# Altium project PumpSystem.PrjPCB (part 5 of 8)

## Sheet [07] - RS232.SchDoc
size A3; DocumentNumber: 8; SheetNumber: 8; SheetTotal: 12
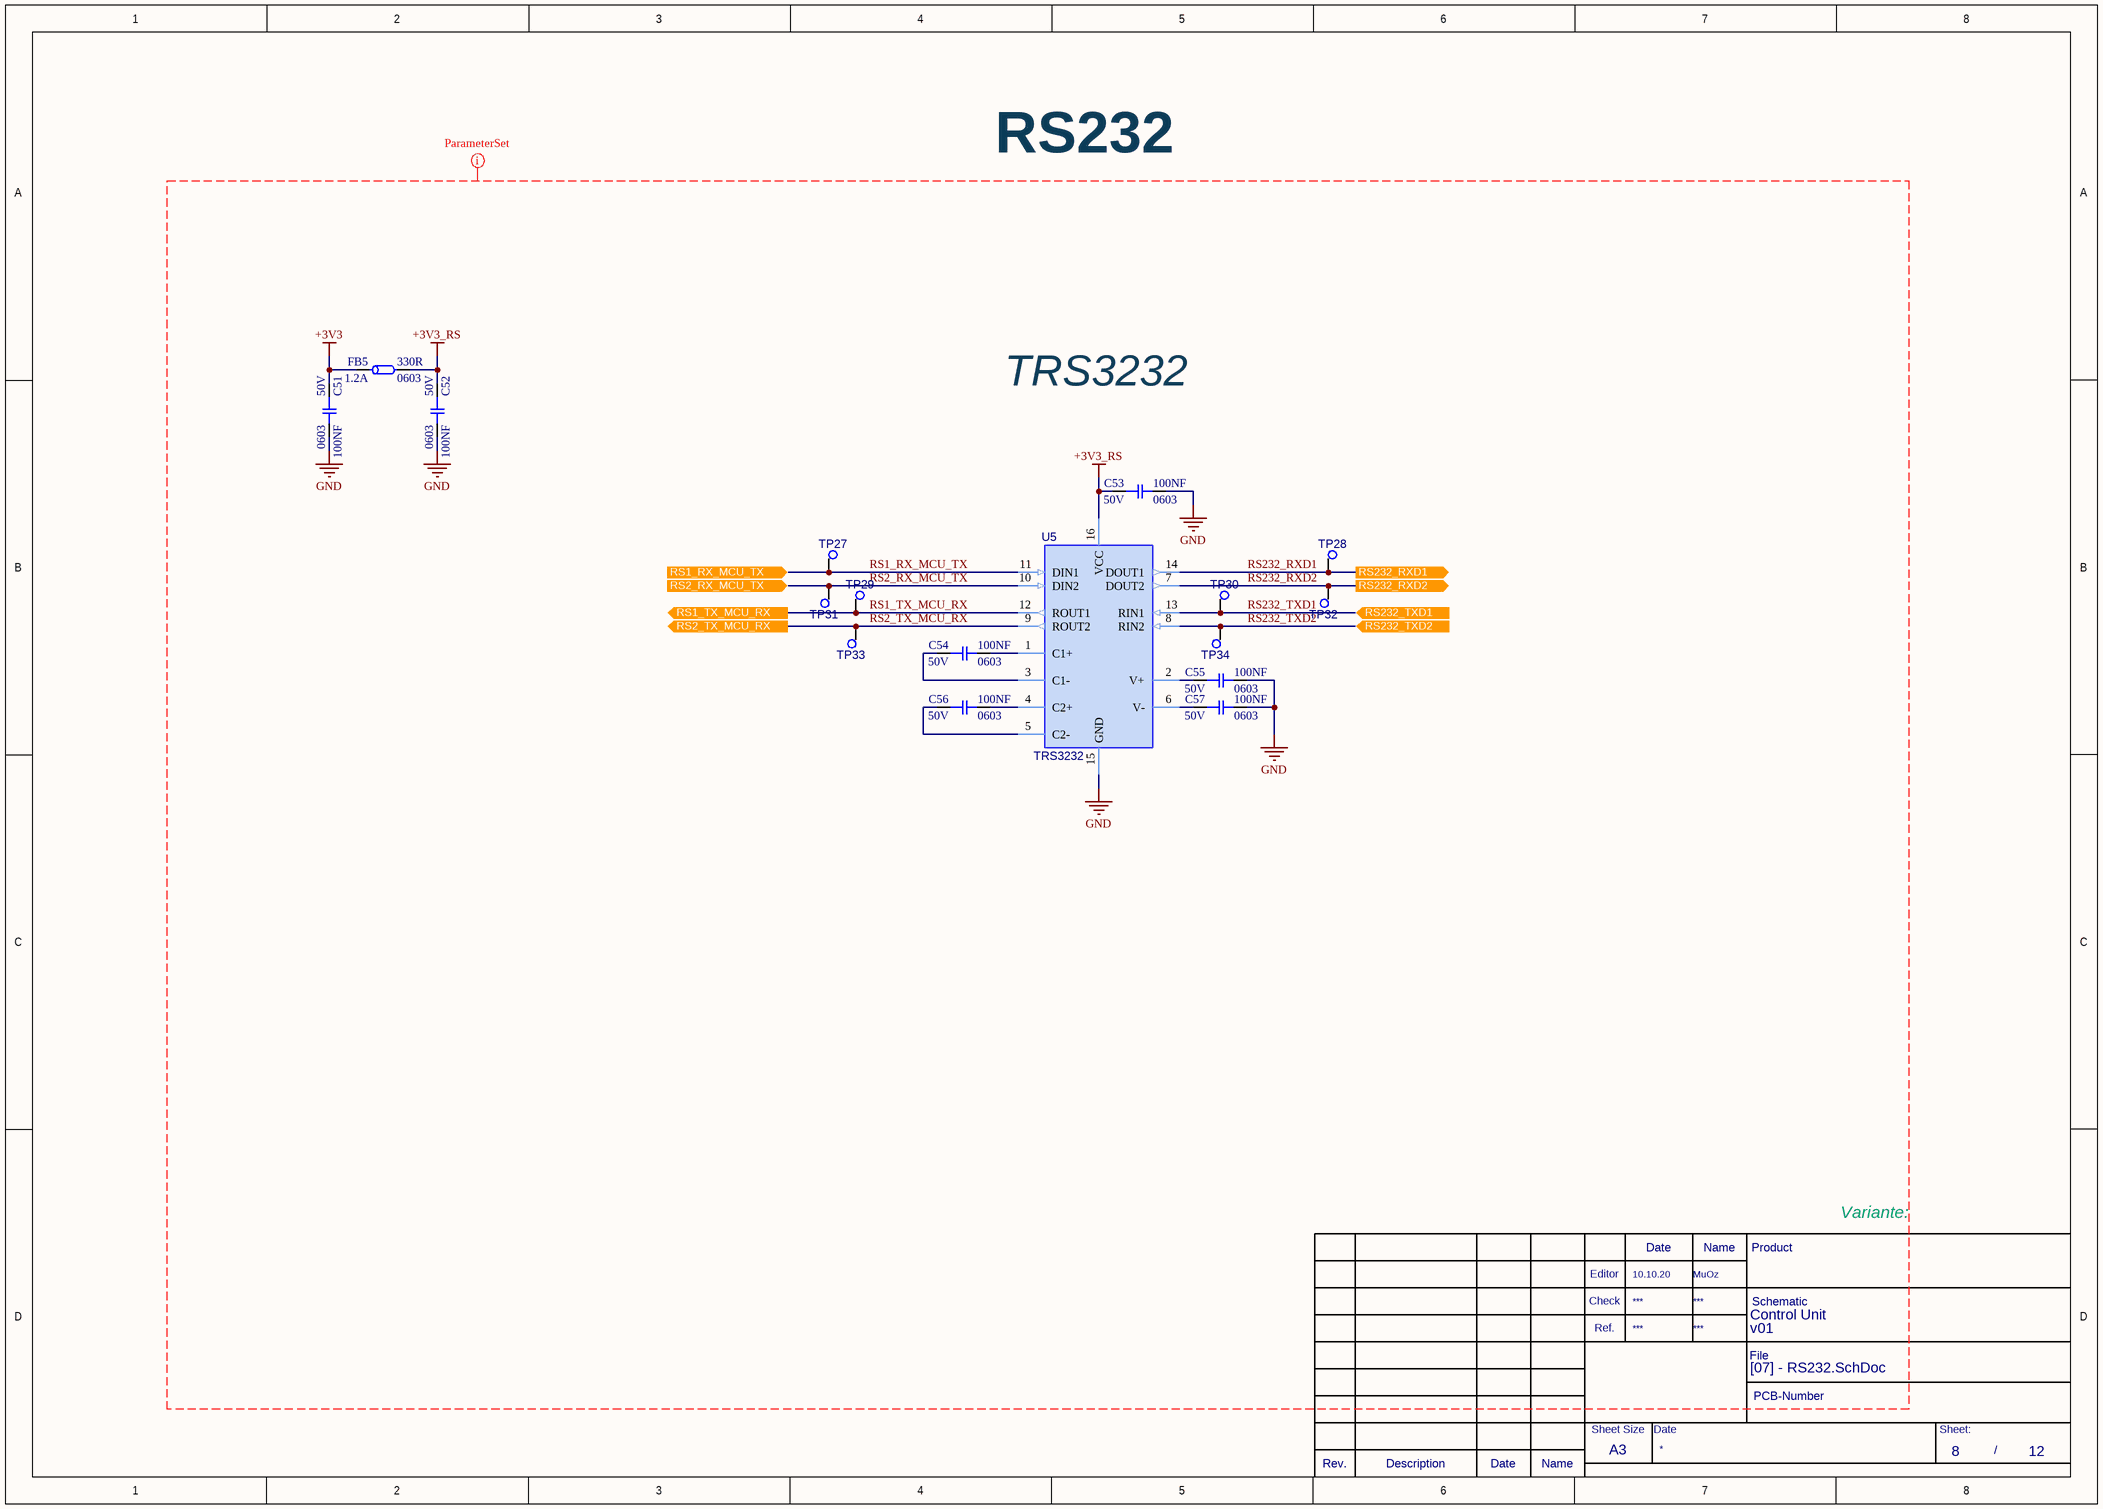
[diagram p7: [07] - RS232.SchDoc]

### Parts
C51  100NF  Voltage Rating: 50V  Case Code (Imperial): 0603  [C-0603]
C52  100NF  Voltage Rating: 50V  Case Code (Imperial): 0603  [C-0603]
C53  100NF  Voltage Rating: 50V  Case Code (Imperial): 0603  [C-0603]
C54  100NF  Voltage Rating: 50V  Case Code (Imperial): 0603  [C-0603]
C55  100NF  Voltage Rating: 50V  Case Code (Imperial): 0603  [C-0603]
C56  100NF  Voltage Rating: 50V  Case Code (Imperial): 0603  [C-0603]
C57  100NF  Voltage Rating: 50V  Case Code (Imperial): 0603  [C-0603]
FB5  330R  Case/Package: 0603  DC Current: 1.2A  [FB-0603]
TP27  MECH-TESTPOINT  [MECH-TESTPOINT]  (value not drawn)  (no BOM)
TP28  MECH-TESTPOINT  [MECH-TESTPOINT]  (value not drawn)  (no BOM)
TP29  MECH-TESTPOINT  [MECH-TESTPOINT]  (value not drawn)  (no BOM)
TP30  MECH-TESTPOINT  [MECH-TESTPOINT]  (value not drawn)  (no BOM)
TP31  MECH-TESTPOINT  [MECH-TESTPOINT]  (value not drawn)  (no BOM)
TP32  MECH-TESTPOINT  [MECH-TESTPOINT]  (value not drawn)  (no BOM)
TP33  MECH-TESTPOINT  [MECH-TESTPOINT]  (value not drawn)  (no BOM)
TP34  MECH-TESTPOINT  [MECH-TESTPOINT]  (value not drawn)  (no BOM)
U5  TRS3232  [TSSOP16]

### Ports
RS1_RX_MCU_TX (in), RS1_TX_MCU_RX (out), RS2_RX_MCU_TX (in), RS2_TX_MCU_RX (out), RS232_RXD1 (out), RS232_RXD2 (out), RS232_TXD1 (in), RS232_TXD2 (in)

### Nets
+3V3: C51.1 FB5.1
+3V3_RS: C52.1 C53.1 FB5.2 U5.16(VCC)
GND: C51.2 C52.2 C53.2 C55.2 C57.2 U5.15(GND)
RS1_RX_MCU_TX: TP27.1 U5.11(DIN1) ; port RS1_RX_MCU_TX
RS1_TX_MCU_RX: TP29.1 U5.12(ROUT1) ; port RS1_TX_MCU_RX
RS2_RX_MCU_TX: TP31.1 U5.10(DIN2) ; port RS2_RX_MCU_TX
RS2_TX_MCU_RX: TP33.1 U5.9(ROUT2) ; port RS2_TX_MCU_RX
RS232_RXD1: TP28.1 U5.14(DOUT1) ; port RS232_RXD1
RS232_RXD2: TP32.1 U5.7(DOUT2) ; port RS232_RXD2
RS232_TXD1: TP30.1 U5.13(RIN1) ; port RS232_TXD1
RS232_TXD2: TP34.1 U5.8(RIN2) ; port RS232_TXD2
NetC54_1: C54.1 U5.3(C1-)
NetC54_2: C54.2 U5.1(C1+)
NetC55_1: C55.1 U5.2(V+)
NetC56_1: C56.1 U5.5(C2-)
NetC56_2: C56.2 U5.4(C2+)
NetC57_1: C57.1 U5.6(V-)

### Layout directives
net class RS232: +3V3, +3V3_RS, GND, RS1_RX_MCU_TX, RS1_TX_MCU_RX, RS2_RX_MCU_TX, RS2_TX_MCU_RX, RS232_RXD1, RS232_RXD2, RS232_TXD1, RS232_TXD2

### Notes on the sheet
- RS232
- TRS3232
- Date
- Name
- Product
- Variante:
- Editor
- Check
- Ref.
- Schematic
- File
- PCB-Number
- Rev.
- Description
- Sheet Size
- A3
- Sheet:
- /

### Library data of the parts
C51-C57 = C-100NF-0603: CAP CER 0.1UF 50V X7R 0603; Manufacturer: TDK; Manufacturer Part Number: C1608X7R1H104K080AA; Tolerance: 10%; Dielectric Material: Ceramic; .PCBCHK: USED; .Creator: F:TALI; Washability: OK; Temperature Coefficient: 30ppm/°C; Mount: Surface Mount; Case/Package: 0603; Case Code (Metric): 1608; Min Operating Temperature: -55°C; Max Operating Temperature: 125°C; Package Quantity: 1; Packaging: Tape and Reel; Features: Soft Termination; Length: 1.6mm; Width: 0.8mm; Thickness: 0.037inch; Lead Free: Lead Free; Capacitance: 100nF; Supplier 1: Digi-Key; Supplier Part Number 1: 445-1314-1-ND; Stock 1: 0; Pricing 1: 1=0.1, 10=0.057, 100=0.0254, 500=0.01812, 1000=0.01423 (USD); Contact Plating: Matte,Tin; Voltage Rating (DC): 50V; Dielectric: X7R; Termination: SMD/SMT; Voltage: 50V; Height: 0.8mm; Depth: 0.8mm; REACH SVHC: No SVHC; ComponentLink1URL: http://www.mouser.com/ds/2/400/lcc_commercial_general_en-837201.pdf; ComponentLink1Description: http://www.mouser.com/ds/2/400/lcc_commercial_general_en-837201.pdf; ComponentLink2URL: https://product.tdk.com/info/en/catalog/spec/mlccspec_commercial_general_midvoltage_en.pdf; ComponentLink2Description: https://product.tdk.com/info/en/catalog/spec/mlccspec_commercial_general_midvoltage_en.pdf; Supplier 2: Digi-Key; Supplier Part Number 2: 478-3540-6-ND; Stock 2: 40000; Pricing 2: 1=0.23, 10=0.161, 100=0.0756, 500=0.05304, 1000=0.0439 (USD); Number of Pins: 2; Radiation Hardening: No; ComponentLink3URL: http://uk.rs-online.com/webdocs/13d1/0900766b813d1103.pdf; ComponentLink3Description: http://uk.rs-online.com/webdocs/13d1/0900766b813d1103.pdf; ComponentLink4URL: http://www.tdk.co.jp/tefe02/e412_c.pdf; ComponentLink4Description: http://www.tdk.co.jp/tefe02/e412_c.pdf; ComponentLink5URL: http://www.farnell.com/datasheets/2291921.pdf; ComponentLink5Description: http://www.farnell.com/datasheets/2291921.pdf; ComponentLink6URL: http://www.farnell.com/datasheets/1744655.pdf; ComponentLink6Description: http://www.farnell.com/datasheets/1744655.pdf; ComponentLink7URL: http://catalogs.avx.com/SurfaceMount.pdf; ComponentLink7Description: http://catalogs.avx.com/SurfaceMount.pdf; ComponentLink8URL: http://www.farnell.com/datasheets/630895.pdf; ComponentLink8Description: http://www.farnell.com/datasheets/630895.pdf; ComponentLink9URL: http://www.avx.com/docs/Catalogs/cx7r.pdf; ComponentLink9Description: http://www.avx.com/docs/Catalogs/cx7r.pdf; ComponentLink10URL: http://www.avx.com/docs/catalogs/cauto.pdf; ComponentLink10Description: http://www.avx.com/docs/catalogs/cauto.pdf; .SCHCHK: USED; Weight: 7.1E-05oz; Composition: Ceramic; ComponentLink11URL: https://www.verical.com/server-webapp/html/getDatasheet?partID=98691; ComponentLink11Description: https://www.verical.com/server-webapp/html/getDatasheet?partID=98691; ComponentLink12URL: https://www.avx.com/docs/Catalogs/flexiterm.pdf; ComponentLink12Description: https://www.avx.com/docs/Catalogs/flexiterm.pdf
FB5 = FB-330R-0603: FERRITE BEAD 330 OHM 0603 1LN; Manufacturer: Murata; Manufacturer Part Number: BLM18PG331SN1D; Material: Steel,Ferrite; Tolerance: 25%; DC Resistance (DCR): 150mR; Number of Lines: 1; Test Frequency: 100MHz; Shielding: Unshielded; Washability: OK; .Creator: M.OZKAN; .PCBCHK: USED; Supplier 1: Digi-Key; RoHS: Yes; Number of Pins: 2; Core Material: Ferrite; Case Code (Metric): 1608; Case Code (Imperial): 0603; Min Operating Temperature: -55°C; Max Operating Temperature: 125°C; Impedance: 330R; Package Quantity: 1; Packaging: Tape and Reel; Current Rating: 1.2A; Max Current Rating: 1.2A; Termination: SMD/SMT; Number of Circuits: 1; Length: 1.75mm; Height: 0.8mm; Width: 0.8mm; Depth: 0.95mm; Radiation Hardening: No; REACH SVHC: No SVHC; Lead Free: Lead Free; ComponentLink1URL: https://datasheet.ciiva.com/6211/enfa0003-6211710.pdf?src-supplier=Digi-Key; ComponentLink1Description: https://datasheet.ciiva.com/6211/enfa0003-6211710.pdf?src-supplier=Digi-Key; Supplier Part Number 1: 490-5222-1-ND; Max DC Current: 1.2A; .SCHCHK: USED; Stock: 106218; Pricing: 1=0.1, 10=0.076, 25=0.0684, 50=0.05, 100=0.0433, 250=0.0342, 500=0.0288, 1000=0.0243 (USD)
TP27-TP34 = MECH-TESTPOINT: .PCBCHK: USED; .Creator: F:TALI; Washability: OK; .SCHCHK: USED
U5 = IC-TRS3232ECPWR: IC TRANSCEIVER FULL 2/2 16TSSOP; Manufacturer 1: Texas Instruments; Number of Receivers: 2; Data Rate: 250Kbps; Max Supply Voltage: 5.5V; Min Supply Voltage: 3V; Nominal Supply Current: 1mA; Logic Function: Transceiver,Receiver; Number of Transceivers: 1; Operating Supply Voltage: 5V; Number of I/Os: 8; Propagation Delay: 0.3us; Simplex/Duplex: Full Duplex; Supplier 1: Digi-Key; RoHS: Yes; Category: RS-232 / RS-422 / RS-485 Interface ICs; Stock 1: 4372; Pricing 1: 1=1,16000, 10=1,03300, 25=0,98000, 100=0,75250, 250=0,66500, 500=0,63000, 1000=0,49000 (USD); Mount: Surface Mount; Case/Package: TSSOP; Number of Pins: 16; Weight: 0.002183oz; Min Operating Temperature: -40°C; Max Operating Temperature: 85°C; Packaging: Tape and Reel; Number of Transmitters: 2; Package Quantity: 1; Number of Drivers: 2; Lead Free: Lead Free; REACH SVHC: No SVHC; ComponentLink1URL: https://datasheet.ciiva.com/7295/1764481-7295873.pdf?src-supplier=Newark; ComponentLink1Description: https://datasheet.ciiva.com/7295/1764481-7295873.pdf?src-supplier=Newark; ComponentLink2URL: https://datasheet.ciiva.com/41461/001187063-da-01-en-ic-multich-rs2-trs3232ecpwr-tssop-16-tid-41461747.pdf?src-supplier=Conrad; ComponentLink2Description: https://datasheet.ciiva.com/41461/001187063-da-01-en-ic-multich-rs2-trs3232ecpwr-tssop-16-tid-41461747.pdf?src-supplier=Conrad; ComponentLink3URL: https://datasheet.ciiva.com/1702/trs3232e-1702920.pdf?src-supplier=Digi-Key; ComponentLink3Description: https://datasheet.ciiva.com/1702/trs3232e-1702920.pdf?src-supplier=Digi-Key; ComponentLink4URL: https://datasheet.ciiva.com/1702/trs3232e-1702921.pdf?src-supplier=Digi-Key; ComponentLink4Description: https://datasheet.ciiva.com/1702/trs3232e-1702921.pdf?src-supplier=Digi-Key; ComponentLink5URL: https://datasheet.ciiva.com/1702/trs3232e-1702875.pdf?src-supplier=Digi-Key; ComponentLink5Description: https://datasheet.ciiva.com/1702/trs3232e-1702875.pdf?src-supplier=Digi-Key; ComponentLink6URL: https://datasheet.ciiva.com/41677/1838938-41677467.pdf?src-supplier=Newark; ComponentLink6Description: https://datasheet.ciiva.com/41677/1838938-41677467.pdf?src-supplier=Newark; ComponentLink7URL: https://datasheet.ciiva.com/46436/1838938-46436111.pdf?src-supplier=Element14; ComponentLink7Description: https://datasheet.ciiva.com/46436/1838938-46436111.pdf?src-supplier=Element14; Supplier Part Number 1: 296-22596-1-ND; Manufacturer Part Number 1: TRS3232ECPWR

## Sheet [08] - IO-LINK.SchDoc
size A3; DocumentNumber: 9; SheetNumber: 9; SheetTotal: 12
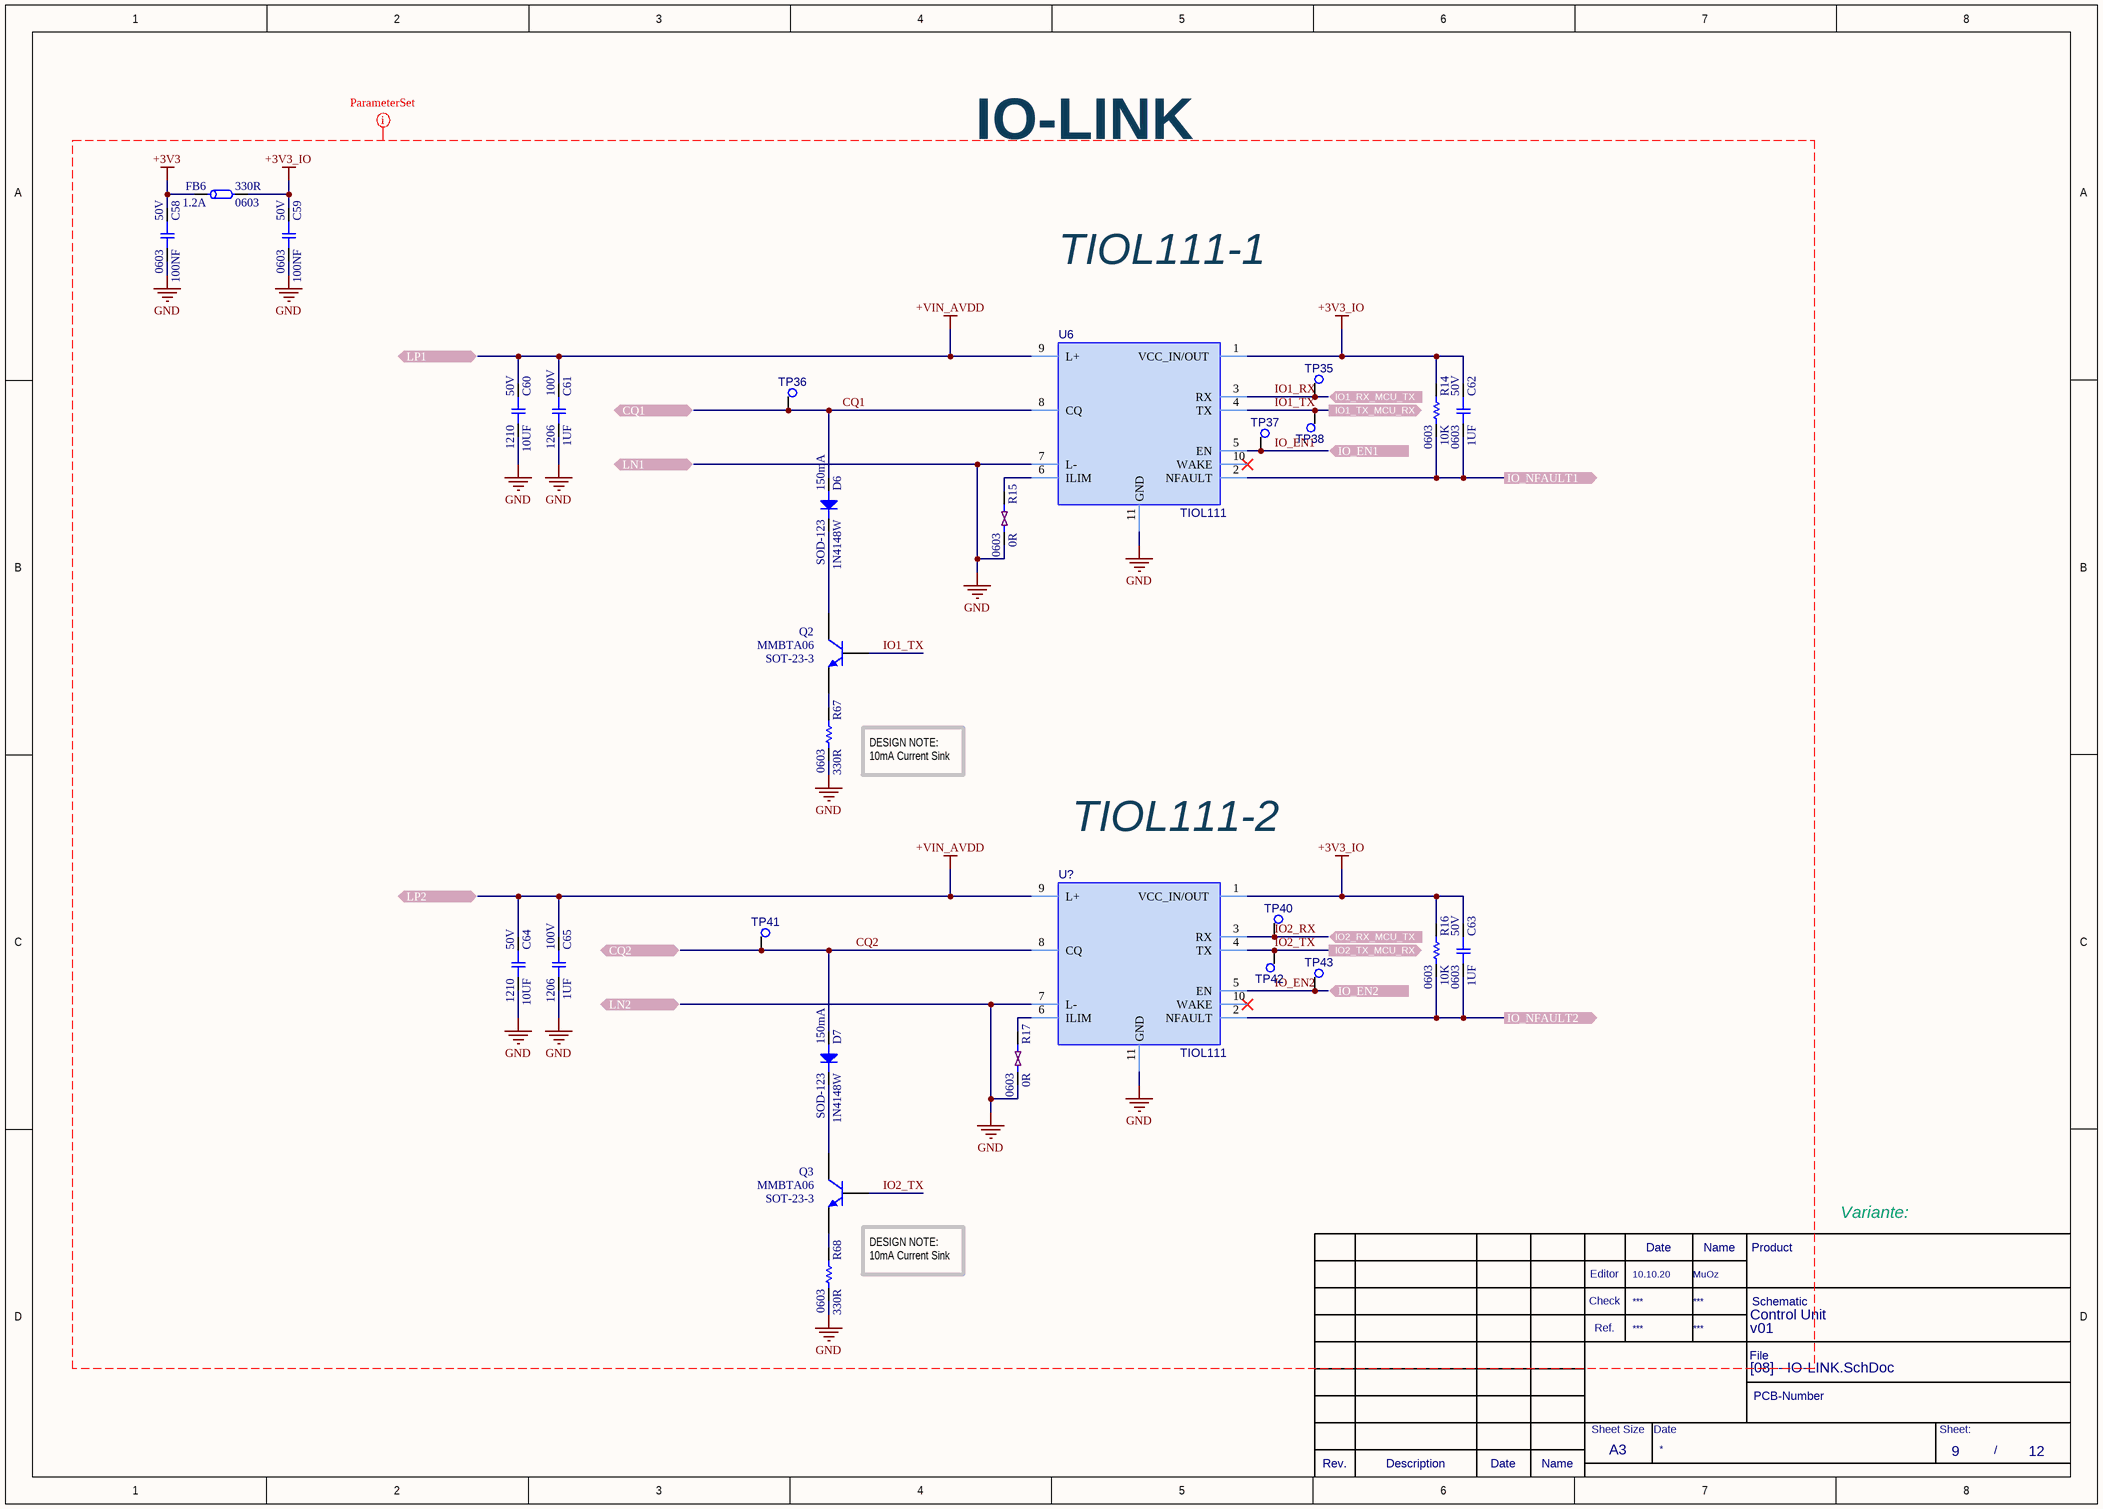
[diagram p8: [08] - IO-LINK.SchDoc]

### Parts
C58  100NF  Voltage Rating: 50V  Case Code (Imperial): 0603  [C-0603]
C59  100NF  Voltage Rating: 50V  Case Code (Imperial): 0603  [C-0603]
C60  10UF  Voltage Rating: 50V  Case/Package: 1210  [C-1210]
C61  1UF  Voltage Rating: 100V  Case Code (Imperial): 1206  [C-1206]
C62  1UF  Voltage Rating: 50V  Case Code (Imperial): 0603  [C-0603]
C63  1UF  Voltage Rating: 50V  Case Code (Imperial): 0603  [C-0603]
C64  10UF  Voltage Rating: 50V  Case/Package: 1210  [C-1210]
C65  1UF  Voltage Rating: 100V  Case Code (Imperial): 1206  [C-1206]
D6  1N4148W  Forward Current: 150mA  Package / Case: SOD-123  [D-SOD123]
D7  1N4148W  Forward Current: 150mA  Package / Case: SOD-123  [D-SOD123]
FB6  330R  Case/Package: 0603  DC Current: 1.2A  [FB-0603]
Q2  MMBTA06  Case/Package: SOT-23-3  [SOT23-3]
Q3  MMBTA06  Case/Package: SOT-23-3  [SOT23-3]
R14  10K  Case Code (Imperial): 0603  [R-0603]
R15  0R  Case Code (Imperial): 0603  [JMP-0603]
R16  10K  Case Code (Imperial): 0603  [R-0603]
R17  0R  Case Code (Imperial): 0603  [JMP-0603]
R67  330R  Case Code (Imperial): 0603  [R-0603]
R68  330R  Case Code (Imperial): 0603  [R-0603]
TP35  MECH-TESTPOINT  [MECH-TESTPOINT]  (value not drawn)  (no BOM)
TP36  MECH-TESTPOINT  [MECH-TESTPOINT]  (value not drawn)  (no BOM)
TP37  MECH-TESTPOINT  [MECH-TESTPOINT]  (value not drawn)  (no BOM)
TP38  MECH-TESTPOINT  [MECH-TESTPOINT]  (value not drawn)  (no BOM)
TP40  MECH-TESTPOINT  [MECH-TESTPOINT]  (value not drawn)  (no BOM)
TP41  MECH-TESTPOINT  [MECH-TESTPOINT]  (value not drawn)  (no BOM)
TP42  MECH-TESTPOINT  [MECH-TESTPOINT]  (value not drawn)  (no BOM)
TP43  MECH-TESTPOINT  [MECH-TESTPOINT]  (value not drawn)  (no BOM)
U6  TIOL111  [10-VSON EP]
U?  TIOL111  [10-VSON EP]

### Ports
CQ1 (bidir), CQ2 (bidir), IO1_RX_MCU_TX (in), IO1_TX_MCU_RX (out), IO2_RX_MCU_TX (in), IO2_TX_MCU_RX (out), IO_EN1 (in), IO_EN2 (in), IO_NFAULT1 (out), IO_NFAULT2 (out), LN1 (bidir), LN2 (bidir), LP1 (bidir), LP2 (bidir)

### Nets
+3V3: C58.1 FB6.1
+3V3_IO: C59.1 C62.1 C63.1 FB6.2 R14.1 R16.1 U6.1(VCC_IN/OUT) U?.1(VCC_IN/OUT)
+VIN_AVDD: C60.1 C61.1 C64.1 C65.1 U6.9(L+) U?.9(L+) ; port LP1, port LP2
GND: C58.2 C59.2 C60.2 C61.2 C64.2 C65.2 R15.2 R17.2 R67.2 R68.2 U6.7(L-) U6.11(GND) U?.7(L-) U?.11(GND) ; port LN1, port LN2
CQ1: D6.A TP36.1 U6.8(CQ) ; port CQ1
CQ2: D7.A TP41.1 U?.8(CQ) ; port CQ2
IO1_RX: TP35.1 U6.3(RX) ; port IO1_RX_MCU_TX
IO1_TX: Q2.1 TP38.1 U6.4(TX) ; port IO1_TX_MCU_RX
IO2_RX: TP40.1 U?.3(RX) ; port IO2_RX_MCU_TX
IO2_TX: Q3.1 TP42.1 U?.4(TX) ; port IO2_TX_MCU_RX
IO_EN1: TP37.1 U6.5(EN) ; port IO_EN1
IO_EN2: TP43.1 U?.5(EN) ; port IO_EN2
IO_NFAULT1: C62.2 R14.2 U6.2(NFAULT) ; port IO_NFAULT1
IO_NFAULT2: C63.2 R16.2 U?.2(NFAULT) ; port IO_NFAULT2
NetD6_C: D6.C Q2.3
NetD7_C: D7.C Q3.3
NetQ2_2: Q2.2 R67.1
NetQ3_2: Q3.2 R68.1
NetR15_1: R15.1 U6.6(ILIM)
NetR17_1: R17.1 U?.6(ILIM)

Not connected (* = marked no-connect by the designer): U6 10(WAKE)*; U? 10(WAKE)*

### Layout directives
net class IOLINK: +3V3, +3V3_IO, +VIN_AVDD, CQ1, CQ2, GND, IO1_RX, IO1_TX, IO2_RX, IO2_TX, IO_EN1, IO_EN2

### Notes on the sheet
- IO-LINK
- TIOL111-1
- (near R67) DESIGN NOTE:
  10mA Current Sink
- TIOL111-2
- DESIGN NOTE:
  10mA Current Sink
- Date
- Name
- Product
- Variante:
- Editor
- Check
- Ref.
- Schematic
- File
- PCB-Number
- Rev.
- Description
- Sheet Size
- A3
- Sheet:
- /

### Library data of the parts
C58 C59 = C-100NF-0603: as C51 on sheet [07] - RS232; Mount: Surface Mount; Case/Package: 0603; Case Code (Metric): 1608; Min Operating Temperature: -55°C; Max Operating Temperature: 125°C; Package Quantity: 1; Packaging: Tape and Reel; Features: Soft Termination; Length: 1.6mm; Width: 0.8mm; Thickness: 0.037inch; Lead Free: Lead Free; Capacitance: 100nF; Supplier 1: Digi-Key; Supplier Part Number 1: 445-1314-1-ND; Stock 1: 0; Pricing 1: 1=0.1, 10=0.057, 100=0.0254, 500=0.01812, 1000=0.01423 (USD); Contact Plating: Matte,Tin; Voltage Rating (DC): 50V; Dielectric: X7R; Termination: SMD/SMT; Voltage: 50V; Height: 0.8mm; Depth: 0.8mm; REACH SVHC: No SVHC; ComponentLink1URL: http://www.mouser.com/ds/2/400/lcc_commercial_general_en-837201.pdf; ComponentLink1Description: http://www.mouser.com/ds/2/400/lcc_commercial_general_en-837201.pdf; ComponentLink2URL: https://product.tdk.com/info/en/catalog/spec/mlccspec_commercial_general_midvoltage_en.pdf; ComponentLink2Description: https://product.tdk.com/info/en/catalog/spec/mlccspec_commercial_general_midvoltage_en.pdf; Supplier 2: Digi-Key; Supplier Part Number 2: 478-3540-6-ND; Stock 2: 40000; Pricing 2: 1=0.23, 10=0.161, 100=0.0756, 500=0.05304, 1000=0.0439 (USD); Number of Pins: 2; Radiation Hardening: No; ComponentLink3URL: http://uk.rs-online.com/webdocs/13d1/0900766b813d1103.pdf; ComponentLink3Description: http://uk.rs-online.com/webdocs/13d1/0900766b813d1103.pdf; ComponentLink4URL: http://www.tdk.co.jp/tefe02/e412_c.pdf; ComponentLink4Description: http://www.tdk.co.jp/tefe02/e412_c.pdf; ComponentLink5URL: http://www.farnell.com/datasheets/2291921.pdf; ComponentLink5Description: http://www.farnell.com/datasheets/2291921.pdf; ComponentLink6URL: http://www.farnell.com/datasheets/1744655.pdf; ComponentLink6Description: http://www.farnell.com/datasheets/1744655.pdf; ComponentLink7URL: http://catalogs.avx.com/SurfaceMount.pdf; ComponentLink7Description: http://catalogs.avx.com/SurfaceMount.pdf; ComponentLink8URL: http://www.farnell.com/datasheets/630895.pdf; ComponentLink8Description: http://www.farnell.com/datasheets/630895.pdf; ComponentLink9URL: http://www.avx.com/docs/Catalogs/cx7r.pdf; ComponentLink9Description: http://www.avx.com/docs/Catalogs/cx7r.pdf; ComponentLink10URL: http://www.avx.com/docs/catalogs/cauto.pdf; ComponentLink10Description: http://www.avx.com/docs/catalogs/cauto.pdf; .SCHCHK: USED; Weight: 7.1E-05oz; Composition: Ceramic; ComponentLink11URL: https://www.verical.com/server-webapp/html/getDatasheet?partID=98691; ComponentLink11Description: https://www.verical.com/server-webapp/html/getDatasheet?partID=98691; ComponentLink12URL: https://www.avx.com/docs/Catalogs/flexiterm.pdf; ComponentLink12Description: https://www.avx.com/docs/Catalogs/flexiterm.pdf
C60 C64 = C-10UF-1210: CAP CER 10UF 50V X7R 1210; Manufacturer: Samsung; Manufacturer Part Number: CL32B106KBJNNNE; Material: Ceramic; Tolerance: 10%; .PCBCHK: USED; .Creator: M.OZKAN; Washability: OK; Supplier 1: Digi-Key; Supplier Part Number 1: 1276-3387-6-ND; Stock 1: 0; Pricing 1: 1=0.96, 10=0.704, 100=0.483, 500=0.38238 (USD); Mount: Surface Mount; Case Code (Metric): 3225; Case Code (Imperial): 1210; Min Operating Temperature: -55°C; Max Operating Temperature: 125°C; Packaging: Tape and Reel; Package Quantity: 1; Capacitance: 10uF; Dielectric: X7R; Voltage: 50V; Voltage Rating (DC): 50V; Length: 3.2mm; Height: 2.5mm; Width: 0.098inch; Thickness: 0.106inch; Depth: 2.5mm; Radiation Hardening: No; Lead Free: Lead Free; ComponentLink1URL: http://www.samsungsem.com/kr/support/product-search/mlcc/CL32B106KBJNNNE .jsp; ComponentLink1Description: http://www.samsungsem.com/kr/support/product-search/mlcc/CL32B106KBJNNNE .jsp; ComponentLink2URL: https://produktinfo.conrad.com/datenblaetter/450000-474999/450821-da-01-en-VS_KONDENSATOR_1210.pdf; ComponentLink2Description: https://produktinfo.conrad.com/datenblaetter/450000-474999/450821-da-01-en-VS_KONDENSATOR_1210.pdf; Supplier 2: Digi-Key; Supplier Part Number 2: 587-3167-6-ND; Stock 2: 0; Pricing 2: 1=1.02, 10=0.755, 100=0.5175 (USD); Termination: SMD/SMT; Halogen Free: Halogen Free; ComponentLink3URL: https://www.yuden.co.jp/productdata/catalog/mlcc_all_e.pdf; ComponentLink3Description: https://www.yuden.co.jp/productdata/catalog/mlcc_all_e.pdf; Supplier 3: Digi-Key; Supplier Part Number 3: 1276-3388-6-ND; Stock 3: 0; Pricing 3: 1=0.86, 10=0.61, 100=0.4017, 500=0.29756 (USD); ComponentLink4URL: http://www.samsungsem.com/kr/support/product-search/mlcc/CL32B106KBJNNWE.jsp; ComponentLink4Description: http://www.samsungsem.com/kr/support/product-search/mlcc/CL32B106KBJNNWE.jsp; .SCHCHK: USED
C61 C65 = C-1UF-1206: CAP CER 1UF 100V X7R 1206; Manufacturer: Samsung; Manufacturer Part Number: CL31B105KCHNNNE; Tolerance: 10%; .PCBCHK: CHECKED; .Creator: M.OZKAN; Washability: OK; Supplier 1: Digi-Key; Supplier Part Number 1: 1276-1838-6-ND; Stock 1: 0; Pricing 1: 1=0.36, 10=0.251, 100=0.1506, 500=0.11298, 1000=0.0954 (USD); Mount: Surface Mount; Case/Package: 1206; Case Code (Metric): 3216; Contact Plating: Tin; Min Operating Temperature: -55°C; Max Operating Temperature: 125°C; Packaging: Tape and Reel; Capacitance: 1uF; Dielectric: X7R; Length: 3.2mm; Height: 1.6mm; Width: 0.063inch; Thickness: 0.071inch; Depth: 1.6mm; Radiation Hardening: No; ComponentLink1URL: http://www.samsungsem.com/kr/support/product-search/mlcc/CL31B105KCHNNNE.jsp; ComponentLink1Description: http://www.samsungsem.com/kr/support/product-search/mlcc/CL31B105KCHNNNE.jsp; ComponentLink2URL: http://www1.futureelectronics.com/doc/SAMSUNG/CLSERIES.pdf; ComponentLink2Description: http://www1.futureelectronics.com/doc/SAMSUNG/CLSERIES.pdf; Supplier 2: Digi-Key; Supplier Part Number 2: 478-11459-6-ND; Stock 2: 142; Pricing 2: 1=1.2, 10=0.949, 100=0.7116, 500=0.53762, 1000=0.47438 (USD); Voltage Rating (DC): 100V; Package Quantity: 2000; Termination: SMD/SMT; ComponentLink3URL: http://www.mouser.com/ds/2/40/LD-Series-777051.pdf; ComponentLink3Description: http://www.mouser.com/ds/2/40/LD-Series-777051.pdf; Supplier 3: Digi-Key; Supplier Part Number 3: 445-4467-6-ND; Stock 3: 0; Pricing 3: 1=0.51, 10=0.36, 100=0.2368, 500=0.17538, 1000=0.14907 (USD); Weight: 0.000571oz; Composition: Ceramic; Voltage: 100V; REACH SVHC: No SVHC; Lead Free: Lead Free; ComponentLink4URL: http://www.mouser.com/ds/2/400/lcc_commercial_highvoltage_en-520036.pdf; ComponentLink4Description: http://www.mouser.com/ds/2/400/lcc_commercial_highvoltage_en-520036.pdf; ComponentLink5URL: http://uk.rs-online.com/webdocs/1532/0900766b81532cd0.pdf; ComponentLink5Description: http://uk.rs-online.com/webdocs/1532/0900766b81532cd0.pdf; ComponentLink6URL: http://www.farnell.com/datasheets/1484596.pdf; ComponentLink6Description: http://www.farnell.com/datasheets/1484596.pdf; ComponentLink7URL: http://product.tdk.com/en/catalog/datasheets/mlcc_commercial_midvoltage_en.pdf; ComponentLink7Description: http://product.tdk.com/en/catalog/datasheets/mlcc_commercial_midvoltage_en.pdf; .SCHCHK: CHECKED
C62 C63 = C-1UF-0603_1: CAP CER 1UF 50V X7R 0603; Manufacturer: Yageo; Manufacturer Part Number: CC0603KRX7R9BB105; Tolerance: 10%; .PCBCHK: USED; .Creator: M.OZKAN; Washability: OK; Supplier 1: Digi-Key; Supplier Part Number 1: 311-2082-1-ND; Stock 1: 0; Mount: Surface Mount; Case/Package: 0603; Weight: 7.1E-05oz; Case Code (Metric): 1608; Min Operating Temperature: -55°C; Max Operating Temperature: 125°C; Packaging: Tape and Reel; Package Quantity: 4000; Termination: SMD/SMT; Capacitance: 1uF; Voltage Rating (DC): 50V; Dielectric: X7R; Composition: Ceramic; Length: 0.063inch; Height: 0.8mm; Width: 0.031inch; Thickness: 0.035inch; Depth: 0.8mm; Radiation Hardening: No; Lead Free: Lead Free; ComponentLink1URL: https://www.yuden.co.jp/productdata/catalog/mlcc_all_e.pdf; ComponentLink1Description: https://www.yuden.co.jp/productdata/catalog/mlcc_all_e.pdf; ComponentLink2URL: http://datasheet.octopart.com/06035C105KAT2A-AVX-datasheet-13516023.pdf; ComponentLink2Description: http://datasheet.octopart.com/06035C105KAT2A-AVX-datasheet-13516023.pdf; .SCHCHK: USED; Halogen Free: Halogen Free; Supplier 2: Digi-Key; Supplier Part Number 2: 587-3247-6-ND; Stock 2: 0; Pricing 2: 1=0.29, 10=0.198, 100=0.1124, 500=0.07936, 1000=0.06943 (USD); Supplier 3: Digi-Key; Supplier Part Number 3: 478-10073-6-ND; Stock 3: 0; Pricing 3: 1=0.73, 10=0.519, 100=0.3416, 500=0.253, 1000=0.21505 (USD)
D6 D7 = D-1N4148W-SOD123: DIODE GEN PURP 100V 150MA SOD123; Manufacturer: MCC; Manufacturer Part Number: 1N4148W-TP; Max Surge Current: 2A; Forward Voltage: 1V; Recovery Time: 4ns; Max Reverse Leakage Current: 5uA; Power Dissipation: 400mW; Max Forward Surge Current (Ifsm): 1A; Element Configuration: Single; Polarity: Standard; Capacitance: 4pF; .PCBCHK: USED; .Creator: F:TALI; Washability: OK; Supplier 1: Digi-Key; Stock 1: 1558891; Pricing 1: 1=0.14, 10=0.131, 100=0.0856, 500=0.04186, 1000=0.02854 (USD); Mount: Surface Mount; Number of Pins: 2; Min Operating Temperature: -65°C; Max Operating Temperature: 150°C; Packaging: Tape and Reel; Package Quantity: 3000; Average Rectified Current: 150mA; Reverse Recovery Time: 4ns; Max Repetitive Reverse Voltage (Vrrm): 100V; Peak Non-Repetitive Surge Current: 2A; Voltage Rating (DC): 100V; Current Rating: 150mA; Output Current: 150mA; Max Reverse Voltage (DC): 100V; Length: 2.85mm; Height: 1.2mm; Width: 1.8mm; Radiation Hardening: No; REACH SVHC: Unknown; Lead Free: Lead Free; ComponentLink1URL: http://www.farnell.com/datasheets/1684829.pdf; ComponentLink1Description: http://www.farnell.com/datasheets/1684829.pdf; ComponentLink2URL: http://www.mccsemi.com/up_pdf/1N4148W(SOD123).pdf; ComponentLink2Description: http://www.mccsemi.com/up_pdf/1N4148W(SOD123).pdf; ComponentLink3URL: http://www.mouser.com/ds/2/258/1N4148W(SOD123)-349435.pdf; ComponentLink3Description: http://www.mouser.com/ds/2/258/1N4148W(SOD123)-349435.pdf; ComponentLink4URL: http://www.alliedelec.com/images/products/datasheets/bm/MCC/70055519.pdf; ComponentLink4Description: http://www.alliedelec.com/images/products/datasheets/bm/MCC/70055519.pdf; Supplier Part Number 1: 1N4148WTPMSDKR-ND; Parameter 2: *; .SCHCHK: USED
FB6 = FB-330R-0603: as FB5 on sheet [07] - RS232; Supplier 1: Digi-Key; RoHS: Yes; Number of Pins: 2; Core Material: Ferrite; Case Code (Metric): 1608; Case Code (Imperial): 0603; Min Operating Temperature: -55°C; Max Operating Temperature: 125°C; Impedance: 330R; Package Quantity: 1; Packaging: Tape and Reel; Current Rating: 1.2A; Max Current Rating: 1.2A; Termination: SMD/SMT; Number of Circuits: 1; Length: 1.75mm; Height: 0.8mm; Width: 0.8mm; Depth: 0.95mm; Radiation Hardening: No; REACH SVHC: No SVHC; Lead Free: Lead Free; ComponentLink1URL: https://datasheet.ciiva.com/6211/enfa0003-6211710.pdf?src-supplier=Digi-Key; ComponentLink1Description: https://datasheet.ciiva.com/6211/enfa0003-6211710.pdf?src-supplier=Digi-Key; Supplier Part Number 1: 490-5222-1-ND; Max DC Current: 1.2A; .SCHCHK: USED; Stock: 106218; Pricing: 1=0.1, 10=0.076, 25=0.0684, 50=0.05, 100=0.0433, 250=0.0342, 500=0.0288, 1000=0.0243 (USD)
Q2 Q3 = Q-MMBTA06: TRANS NPN 80V 0.5A SOT23; Manufacturer: ON Semiconductor; Manufacturer Part Number: MMBTA06LT1G; .Creator: F:TALI; .PCBCHK: USED; Max Power Dissipation: 225mW; Number of Elements: 1; Frequency: 100MHz; Emitter Base Voltage (VEBO): 4V; Collector Emitter Saturation Voltage: 250mV; Max Collector Current: 500mA; Power Dissipation: 300mW; Element Configuration: Single; hFE Min: 100; ComponentLink1URL: http://www.fairchildsemi.com/ds/MM/MMBTA06.pdf; ComponentLink1Description: http://www.fairchildsemi.com/ds/MM/MMBTA06.pdf; ComponentLink2URL: http://www.farnell.com/datasheets/48137.pdf; ComponentLink2Description: http://www.farnell.com/datasheets/48137.pdf; ComponentLink3URL: http://www.farnell.com/datasheets/1852077.pdf; ComponentLink3Description: http://www.farnell.com/datasheets/1852077.pdf; ComponentLink4URL: http://www.fairchildsemi.com/datasheets/MP/MPSA06.pdf; ComponentLink4Description: http://www.fairchildsemi.com/datasheets/MP/MPSA06.pdf; ComponentLink5URL: http://www.mouser.com/ds/2/149/MMBTA06-196120.pdf; ComponentLink5Description: http://www.mouser.com/ds/2/149/MMBTA06-196120.pdf; ComponentLink6URL: https://www.verical.com/server-webapp/html/getDatasheet?partID=130058; ComponentLink6Description: https://www.verical.com/server-webapp/html/getDatasheet?partID=130058; .SCHCHK: USED; Supplier 1: Digi-Key; Supplier Part Number 1: MMBTA06LT1GOSCT-ND; Stock: 165416; Pricing: 1=0.16, 10=0.15, 25=0.1424, 100=0.0627, 250=0.0602, 500=0.0492, 1000=0.0342 (USD); RoHS: Yes; Number of Pins: 3; Contact Plating: Tin,Matte; Min Operating Temperature: -55°C; Max Operating Temperature: 150°C; Package Quantity: 1; Collector Emitter Voltage (VCEO): 80V; Packaging: Tape and Reel; Polarity: NPN; Collector Base Voltage (VCBO): 80V; Collector Emitter Breakdown Voltage: 80V; Transition Frequency: 100MHz; Max Breakdown Voltage: 80V; Max Frequency: 100MHz; Gain Bandwidth Product: 100MHz; Voltage Rating (DC): 80V; Current Rating: 500mA; Length: 0.119inch; Height: 0.04inch; Width: 0.055inch; Radiation Hardening: No; REACH SVHC: No SVHC; Lead Free: Lead Free; ComponentLink7URL: https://datasheet.ciiva.com/4722/mmbta05lt1-d-101659-4722113.pdf?src-supplier=Mouser; ComponentLink7Description: https://datasheet.ciiva.com/4722/mmbta05lt1-d-101659-4722113.pdf?src-supplier=Mouser; ComponentLink8URL: https://datasheet.ciiva.com/15139/getdatasheetpartid-137838-15139444.pdf?src-supplier=Verical; ComponentLink8Description: https://datasheet.ciiva.com/15139/getdatasheetpartid-137838-15139444.pdf?src-supplier=Verical; ComponentLink9URL: https://datasheet.ciiva.com/16465/mmbta05lt1-d-16465685.pdf?src-supplier=Future+Electronics; ComponentLink9Description: https://datasheet.ciiva.com/16465/mmbta05lt1-d-16465685.pdf?src-supplier=Future+Electronics; ComponentLink10URL: https://datasheet.ciiva.com/11197/mmbta05lt1-d-11197414.pdf?src-supplier=Avnet; ComponentLink10Description: https://datasheet.ciiva.com/11197/mmbta05lt1-d-11197414.pdf?src-supplier=Avnet; ComponentLink11URL: https://datasheet.ciiva.com/11198/mmbta05lt1-d-11198678.pdf?src-supplier=Avnet; ComponentLink11Description: https://datasheet.ciiva.com/11198/mmbta05lt1-d-11198678.pdf?src-supplier=Avnet; ComponentLink12URL: https://datasheet.ciiva.com/976/mmbta05lt1-d-976473.pdf?src-supplier=Digi-Key; ComponentLink12Description: https://datasheet.ciiva.com/976/mmbta05lt1-d-976473.pdf?src-supplier=Digi-Key; ComponentLink13URL: https://datasheet.ciiva.com/976/mmbta05lt1-d-976474.pdf?src-supplier=Digi-Key; ComponentLink13Description: https://datasheet.ciiva.com/976/mmbta05lt1-d-976474.pdf?src-supplier=Digi-Key; ComponentLink14URL: https://datasheet.ciiva.com/976/mmbta05lt1-d-976475.pdf?src-supplier=Digi-Key; ComponentLink14Description: https://datasheet.ciiva.com/976/mmbta05lt1-d-976475.pdf?src-supplier=Digi-Key; ComponentLink15URL: https://datasheet.ciiva.com/7972/mmbta05lt1-d-7972078.pdf?src-supplier=Element14; ComponentLink15Description: https://datasheet.ciiva.com/7972/mmbta05lt1-d-7972078.pdf?src-supplier=Element14; ComponentLink16URL: https://datasheet.ciiva.com/16478/mmbta05lt1-d-16478574.pdf?src-supplier=Avnet+Asia; ComponentLink16Description: https://datasheet.ciiva.com/16478/mmbta05lt1-d-16478574.pdf?src-supplier=Avnet+Asia; ComponentLink17URL: https://datasheet.ciiva.com/25998/mmbta05lt1-d-25998830.pdf?src-supplier=Avnet+Europe; ComponentLink17Description: https://datasheet.ciiva.com/25998/mmbta05lt1-d-25998830.pdf?src-supplier=Avnet+Europe
R14 R16 = R-10K-0603: RES SMD 10K OHM 1% 1/10W 0603; Manufacturer: Yageo; Manufacturer Part Number: RC0603FR-0710KL; Resistance: 10kR; Temperature Coefficient: 100ppm/°C; Voltage Rating (DC): 50V; Power Rating: 100mW; Voltage Rating: 75V; .PCBCHK: USED; .Creator: F:TALI; Washability: OK; Supplier 1: Digi-Key; Supplier Part Number 1: 311-10.0KHRCT-ND; Stock 1: 37479107; Pricing 1: 1=0.1, 10=0.026, 100=0.0107, 1000=0.00478, 2500=0.00415 (USD); Case/Package: 0603; Number of Pins: 2; Weight: 7.1E-05oz; Case Code (Metric): 1608; Min Operating Temperature: -55°C; Max Operating Temperature: 155°C; Tolerance: 1%; Composition: Thick Film; Packaging: Tape and Reel; Military Standard: Not; Termination: SMD/SMT; Length: 1.6mm; Height: 0.45mm; Width: 0.8mm; Depth: 0.8mm; Lead Pitch: 0.3mm; REACH SVHC: No SVHC; Lead Free: Lead Free; ComponentLink1URL: http://www.farnell.com/datasheets/38590.pdf; ComponentLink1Description: http://www.farnell.com/datasheets/38590.pdf; ComponentLink2URL: https://www.verical.com/server-webapp/html/getDatasheet?partID=409289; ComponentLink2Description: https://www.verical.com/server-webapp/html/getDatasheet?partID=409289; ComponentLink3URL: http://www.farnell.com/datasheets/1868787.pdf; ComponentLink3Description: http://www.farnell.com/datasheets/1868787.pdf; ComponentLink4URL: http://www.farnell.com/datasheets/443971.pdf; ComponentLink4Description: http://www.farnell.com/datasheets/443971.pdf; ComponentLink5URL: http://www.farnell.com/datasheets/1738695.pdf; ComponentLink5Description: http://www.farnell.com/datasheets/1738695.pdf; Supplier 2: Digi-Key; Supplier Part Number 2: 311-10KGRDKR-ND; Stock 2: 34952003; Pricing 2: 1=0.1, 10=0.022, 100=0.0088, 1000=0.00396, 2500=0.00344 (USD); Contact Plating: Matte,Tin; Radiation Hardening: No; ComponentLink6URL: http://www.yageo.com/documents/recent/PYu-RC_Group_51_RoHS_L_9.pdf; ComponentLink6Description: http://www.yageo.com/documents/recent/PYu-RC_Group_51_RoHS_L_9.pdf; ComponentLink7URL: https://www.verical.com/server-webapp/html/getDatasheet?partID=327958; ComponentLink7Description: https://www.verical.com/server-webapp/html/getDatasheet?partID=327958; ComponentLink8URL: http://www.yageo.com/documents/recent/PYu-RC_Group_51_RoHS_L_2.pdf; ComponentLink8Description: http://www.yageo.com/documents/recent/PYu-RC_Group_51_RoHS_L_2.pdf; Mount: Surface Mount; Package Quantity: 1; Number of Terminations: 2; Max Power Dissipation: 100mW; Working Voltage: 75V; Features: Automotive AEC-Q200; ComponentLink9URL: http://www.farnell.com/datasheets/1678796.pdf; ComponentLink9Description: http://www.farnell.com/datasheets/1678796.pdf; ComponentLink10URL: http://industrial.panasonic.com/www-cgi/jvcr13pz.cgi?E+PZ+3+AOA0002+ERJ1GNJ120C+7+WW; ComponentLink10Description: http://industrial.panasonic.com/www-cgi/jvcr13pz.cgi?E+PZ+3+AOA0002+ERJ1GNJ120C+7+WW; ComponentLink11URL: http://industrial.panasonic.com/www-data/pdf/AOA0000/AOA0000CE1.pdf; ComponentLink11Description: http://industrial.panasonic.com/www-data/pdf/AOA0000/AOA0000CE1.pdf; ComponentLink12URL: http://www.jameco.com/Jameco/Products/ProdDS/2007265.pdf; ComponentLink12Description: http://www.jameco.com/Jameco/Products/ProdDS/2007265.pdf; ComponentLink13URL: https://industrial.panasonic.com/cdbs/www-data/pdf/RDA0000/AOA0000C301.pdf; ComponentLink13Description: https://industrial.panasonic.com/cdbs/www-data/pdf/RDA0000/AOA0000C301.pdf; Supplier 3: Digi-Key; Supplier Part Number 3: YAG1290DKR-ND; Stock 3: 0; Pricing 3: 1=0.1, 10=0.044, 100=0.0178, 1000=0.00798, 2500=0.00693 (USD); .SCHCHK: USED
R15 R17 = R-0R-0603: RES SMD 0 OHM 1/10W JUMP 0603; Manufacturer: Yageo; Manufacturer Part Number: RC0603JR-070RL; Resistance: 0mR; Tolerance: 1%; Power Rating: 100mW; Voltage Rating (DC): 50V; Temperature Coefficient: 200ppm/°C; Current Rating: 1A; Working Voltage: 75V; .PCBCHK: USED; .Creator: F:TALI; Washability: OK; Supplier 1: Digi-Key; Supplier Part Number 1: 311-0.0GRDKR-ND; Stock 1: 54397731; Pricing 1: 1=0.1, 10=0.021, 25=0.0152, 50=0.0114, 100=0.0084, 250=0.00644, 500=0.00514, 1000=0.00379 (USD); Case/Package: 0603; Number of Pins: 2; Contact Plating: Matte,Tin; Case Code (Metric): 1608; Min Operating Temperature: -55°C; Max Operating Temperature: 155°C; Composition: Thick Film; Packaging: Tape and Reel; Termination: SMD/SMT; Package Quantity: 5000; Voltage Rating: 50V; Military Standard: Not; Length: 1.6mm; Height: 0.45mm; Width: 0.8mm; Depth: 0.8mm; Radiation Hardening: No; REACH SVHC: No SVHC; Lead Free: Lead Free; ComponentLink1URL: http://www.farnell.com/datasheets/1738695.pdf; ComponentLink1Description: http://www.farnell.com/datasheets/1738695.pdf; ComponentLink2URL: https://www.verical.com/server-webapp/html/getDatasheet?partID=329462; ComponentLink2Description: https://www.verical.com/server-webapp/html/getDatasheet?partID=329462; ComponentLink3URL: http://www.yageo.com/documents/recent/PYu-RC_Group_51_RoHS_L_9.pdf; ComponentLink3Description: http://www.yageo.com/documents/recent/PYu-RC_Group_51_RoHS_L_9.pdf; ComponentLink4URL: http://www.farnell.com/datasheets/443971.pdf; ComponentLink4Description: http://www.farnell.com/datasheets/443971.pdf; ComponentLink5URL: http://documents.rs-components.com/techlib://itc_doclist_GB.htm?stockno=6515918; ComponentLink5Description: http://documents.rs-components.com/techlib://itc_doclist_GB.htm?stockno=6515918; Supplier 2: Digi-Key; Supplier Part Number 2: 311-0.0HRDKR-ND; Stock 2: 6104331; Pricing 2: 1=0.1, 10=0.021, 25=0.0152, 50=0.0114, 100=0.0084, 250=0.00644, 500=0.00514, 1000=0.00379 (USD); Number of Terminations: 2; Max Power Dissipation: 100mW; Features: Moisture Resistant; ComponentLink6URL: http://www.farnell.com/datasheets/1868787.pdf; ComponentLink6Description: http://www.farnell.com/datasheets/1868787.pdf; ComponentLink7URL: http://documents.rs-components.com/techlib://itc_doclist_GB.htm?stockno=5048827; ComponentLink7Description: http://documents.rs-components.com/techlib://itc_doclist_GB.htm?stockno=5048827; Supplier 3: Digi-Key; Supplier Part Number 3: P0.0GDKR-ND; Stock 3: 34178498; Pricing 3: 1=0.1, 10=0.042, 25=0.0304, 50=0.0232, 100=0.0171, 250=0.01308, 500=0.01046, 1000=0.0077 (USD); Mount: Surface Mount; ComponentLink8URL: http://industrial.panasonic.com/www-data/pdf/AOA0000/AOA0000CE1.pdf; ComponentLink8Description: http://industrial.panasonic.com/www-data/pdf/AOA0000/AOA0000CE1.pdf; ComponentLink9URL: http://www.farnell.com/datasheets/2059623.pdf; ComponentLink9Description: http://www.farnell.com/datasheets/2059623.pdf; ComponentLink10URL: http://www.jameco.com/Jameco/Products/ProdDS/1935748.pdf; ComponentLink10Description: http://www.jameco.com/Jameco/Products/ProdDS/1935748.pdf; ComponentLink11URL: http://www.farnell.com/datasheets/1678796.pdf; ComponentLink11Description: http://www.farnell.com/datasheets/1678796.pdf; ComponentLink12URL: http://www.alliedelec.com/m/d/51cd0790071e1666bdb9d00c57fcf960.pdf; ComponentLink12Description: http://www.alliedelec.com/m/d/51cd0790071e1666bdb9d00c57fcf960.pdf; .SCHCHK: USED
R67 R68 = R-330R-0603: RES SMD 330 OHM 5% 1/10W 0603; Manufacturer: Yageo; Manufacturer Part Number: RC0603JR-07330RL; Power Rating: 100mW; Voltage Rating (DC): 50V; Temperature Coefficient: 100ppm/°C; Working Voltage: 75V; .PCBCHK: USED; .Creator: F:TALI; Washability: OK; Stock 1: 0; Pricing 1: 1=0.1, 10=0.022, 100=0.0091, 1000=0.00429, 2500=0.00376 (USD); Case/Package: 0603; Number of Pins: 2; Case Code (Metric): 1608; Min Operating Temperature: -55°C; Max Operating Temperature: 155°C; Resistance: 330R; Tolerance: 5%; Packaging: Tape and Reel; Voltage Rating: 50V; Package Quantity: 5000; Termination: SMD/SMT; Composition: Thick Film; Military Standard: Not; Length: 1.6mm; Height: 0.45mm; Width: 0.8mm; Depth: 0.8mm; REACH SVHC: No SVHC; Lead Free: Lead Free; ComponentLink1URL: http://www.farnell.com/datasheets/1868787.pdf; ComponentLink1Description: http://www.farnell.com/datasheets/1868787.pdf; ComponentLink2URL: http://www.farnell.com/datasheets/443971.pdf; ComponentLink2Description: http://www.farnell.com/datasheets/443971.pdf; ComponentLink3URL: https://www.verical.com/server-webapp/html/getDatasheet?partID=342831; ComponentLink3Description: https://www.verical.com/server-webapp/html/getDatasheet?partID=342831; ComponentLink4URL: http://www.mouser.com/catalog/specsheets/RC0603.pdf; ComponentLink4Description: http://www.mouser.com/catalog/specsheets/RC0603.pdf; Stock 2: 185696; Pricing 2: 1=0.1, 10=0.016, 100=0.0064, 1000=0.00289, 2500=0.0025 (USD); Mount: Surface Mount; Contact Plating: Matte,Tin; Number of Terminations: 2; Max Power Dissipation: 100mW; Features: Automotive AEC-Q200; Radiation Hardening: No; Stock 3: 10218189; Pricing 3: 1=0.1, 10=0.026, 100=0.0107, 1000=0.00478, 2500=0.00415 (USD); ComponentLink5URL: http://www.yageo.com/documents/recent/PYu-RC_Group_51_RoHS_L_9.pdf; ComponentLink5Description: http://www.yageo.com/documents/recent/PYu-RC_Group_51_RoHS_L_9.pdf; ComponentLink6URL: http://www.farnell.com/datasheets/2167052.pdf; ComponentLink6Description: http://www.farnell.com/datasheets/2167052.pdf; ComponentLink7URL: http://www.farnell.com/datasheets/1686128.pdf; ComponentLink7Description: http://www.farnell.com/datasheets/1686128.pdf; ComponentLink8URL: http://documents.rs-components.com/techlib://itc_doclist_GB.htm?stockno=5046499; ComponentLink8Description: http://documents.rs-components.com/techlib://itc_doclist_GB.htm?stockno=5046499; .SCHCHK: USED; Supplier 1: Digi-Key; Supplier Part Number 1: 311-330GRCT-ND; Supplier 2: Digi-Key; Supplier Part Number 2: RMCF0603JT330RCT-ND
TP35-TP38 TP40-TP43 = MECH-TESTPOINT: as TP27 on sheet [07] - RS232; .SCHCHK: USED
U6 U? = IC-TIOL111DMWR: IC TRANSCEIVER 1/1 10VSON; Manufacturer: Texas Instruments; Receiver Hysteresis: 750mV; Data Rate: 250Kbps; Supplier 1: Digi-Key; Supplier Part Number 1: 296-49943-1-ND; Manufacturer Part Number: TIOL111DMWR; Stock: 596; Pricing: 1=3.47, 10=3.12, 25=2.9496, 100=2.4254, 250=2.1763, 500=2.0976 (USD); RoHS: No; Mount: Surface Mount; Min Operating Temperature: -40°C; Max Operating Temperature: 125°C; Packaging: Cut Tape; ComponentLink1URL: http://www.ti.com/lit/ds/symlink/tiol111.pdf?src-supplier=Digi-Key; ComponentLink1Description: http://www.ti.com/lit/ds/symlink/tiol111.pdf?src-supplier=Digi-Key

## Sheet [09] - AFE.SchDoc
size A3; DocumentNumber: 10; SheetNumber: 10; SheetTotal: 12
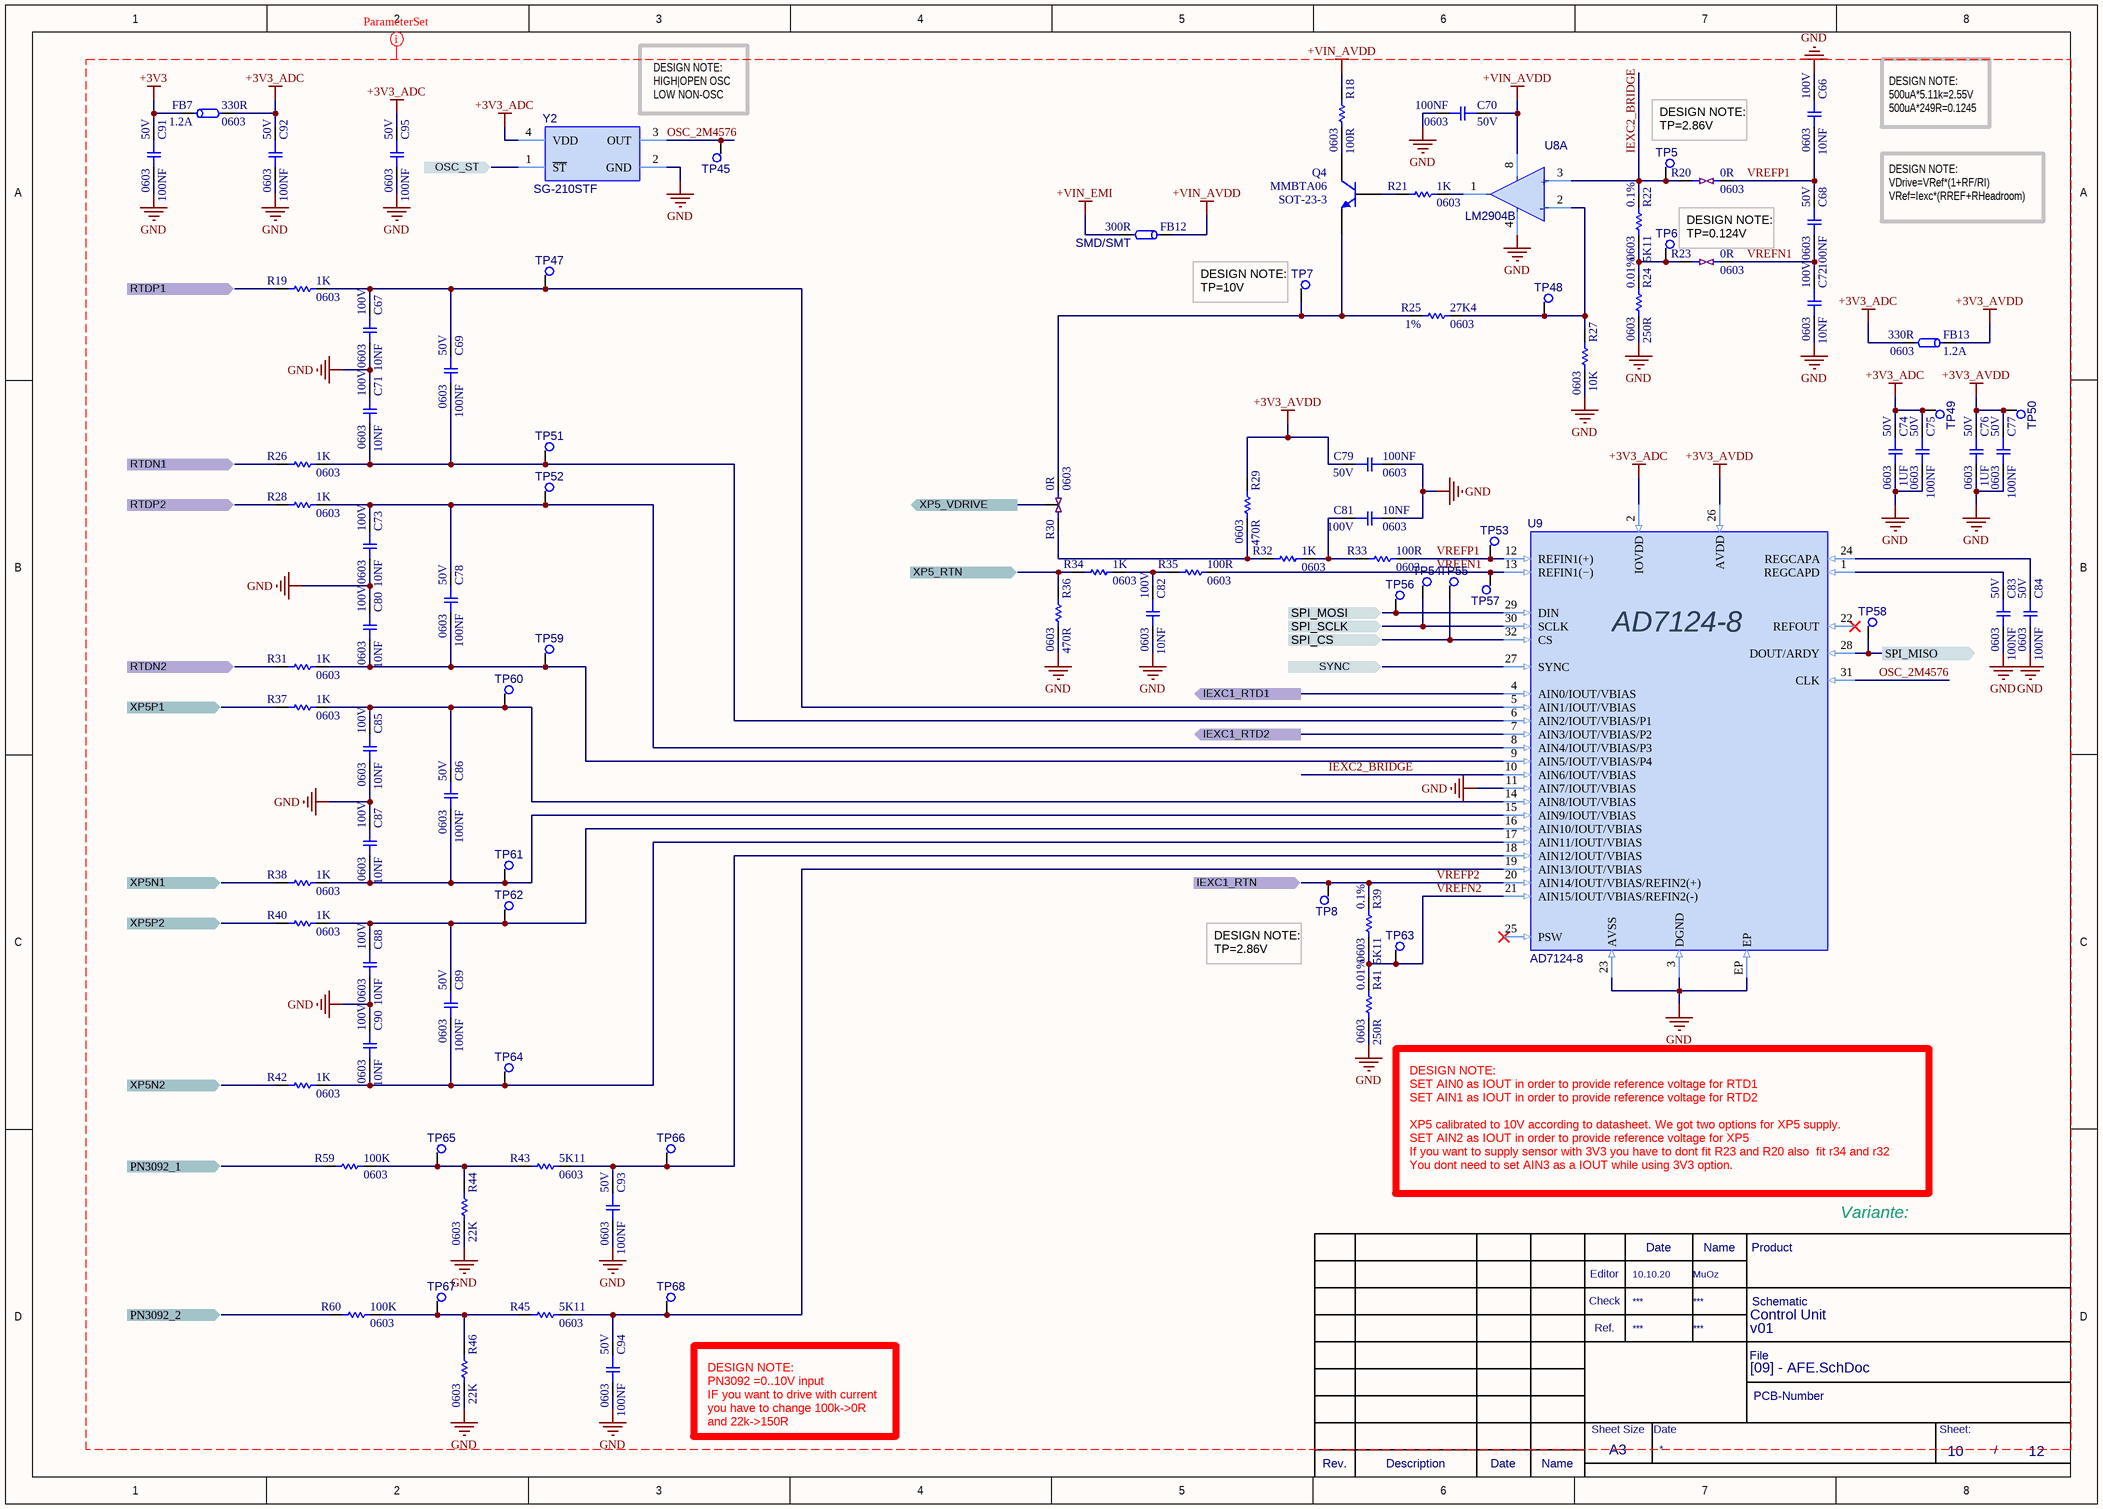
[diagram p9: [09] - AFE.SchDoc]

### Parts
C66  10NF  Voltage Rating: 100V  Case Code (Imperial): 0603  [C-0603]
C67  10NF  Voltage Rating: 100V  Case Code (Imperial): 0603  [C-0603]
C68  100NF  Voltage Rating: 50V  Case/Package: 0603  [C-0603]
C69  100NF  Voltage Rating: 50V  Case/Package: 0603  [C-0603]
C70  100NF  Voltage Rating: 50V  Case Code (Imperial): 0603  [C-0603]
C71  10NF  Voltage Rating: 100V  Case Code (Imperial): 0603  [C-0603]
C72  10NF  Voltage Rating: 100V  Case Code (Imperial): 0603  [C-0603]
C73  10NF  Voltage Rating: 100V  Case Code (Imperial): 0603  [C-0603]
C74  1UF  Voltage Rating: 50V  Case/Package: 0603  [C-0603]
C75  100NF  Voltage Rating: 50V  Case/Package: 0603  [C-0603]
C76  1UF  Voltage Rating: 50V  Case/Package: 0603  [C-0603]
C77  100NF  Voltage Rating: 50V  Case/Package: 0603  [C-0603]
C78  100NF  Voltage Rating: 50V  Case/Package: 0603  [C-0603]
C79  100NF  Voltage Rating: 50V  Case/Package: 0603  [C-0603]
C80  10NF  Voltage Rating: 100V  Case Code (Imperial): 0603  [C-0603]
C81  10NF  Voltage Rating: 100V  Case Code (Imperial): 0603  [C-0603]
C82  10NF  Voltage Rating: 100V  Case Code (Imperial): 0603  [C-0603]
C83  100NF  Voltage Rating: 50V  Case/Package: 0603  [C-0603]
C84  100NF  Voltage Rating: 50V  Case/Package: 0603  [C-0603]
C85  10NF  Voltage Rating: 100V  Case Code (Imperial): 0603  [C-0603]
C86  100NF  Voltage Rating: 50V  Case/Package: 0603  [C-0603]
C87  10NF  Voltage Rating: 100V  Case Code (Imperial): 0603  [C-0603]
C88  10NF  Voltage Rating: 100V  Case Code (Imperial): 0603  [C-0603]
C89  100NF  Voltage Rating: 50V  Case/Package: 0603  [C-0603]
C90  10NF  Voltage Rating: 100V  Case Code (Imperial): 0603  [C-0603]
C91  100NF  Voltage Rating: 50V  Case Code (Imperial): 0603  [C-0603]
C92  100NF  Voltage Rating: 50V  Case Code (Imperial): 0603  [C-0603]
C93  100NF  Voltage Rating: 50V  Case Code (Imperial): 0603  [C-0603]
C94  100NF  Voltage Rating: 50V  Case Code (Imperial): 0603  [C-0603]
C95  100NF  Voltage Rating: 50V  Case Code (Imperial): 0603  [C-0603]
FB7  330R  Case/Package: 0603  DC Current: 1.2A  [FB-0603]
FB12  300R  Case/Package: SMD/SMT  [FB-1206]
FB13  330R  Case/Package: 0603  DC Current: 1.2A  [FB-0603]
Q4  MMBTA06  Case/Package: SOT-23-3  [SOT23-3]
R18  100R  Case Code (Imperial): 0603  [R-0603]
R19  1K  Case Code (Imperial): 0603  [R-0603]
R20  0R  Case Code (Imperial): 0603  [JMP-0603]
R21  1K  Case Code (Imperial): 0603  [R-0603]
R22  5K11  Tolerance: 0.1%  Case/Package: 0603  [R-0603]
R23  0R  Case Code (Imperial): 0603  [JMP-0603]
R24  250R  Tolerance: 0.01%  Case/Package: 0603  [R-0603]
R25  27K4  Tolerance: 1%  Case/Package: 0603  [R-0603]
R26  1K  Case Code (Imperial): 0603  [R-0603]
R27  10K  Case Code (Imperial): 0603  [R-0603]
R28  1K  Case Code (Imperial): 0603  [R-0603]
R29  470R  Case Code (Imperial): 0603  [R-0603]
R30  0R  Case Code (Imperial): 0603  [R-0603 - 3 Pad]
R31  1K  Case Code (Imperial): 0603  [R-0603]
R32  1K  Case Code (Imperial): 0603  [R-0603]
R33  100R  Case Code (Imperial): 0603  [R-0603]
R34  1K  Case Code (Imperial): 0603  [R-0603]
R35  100R  Case Code (Imperial): 0603  [R-0603]
R36  470R  Case Code (Imperial): 0603  [R-0603]
R37  1K  Case Code (Imperial): 0603  [R-0603]
R38  1K  Case Code (Imperial): 0603  [R-0603]
R39  5K11  Tolerance: 0.1%  Case/Package: 0603  [R-0603]
R40  1K  Case Code (Imperial): 0603  [R-0603]
R41  250R  Tolerance: 0.01%  Case/Package: 0603  [R-0603]
R42  1K  Case Code (Imperial): 0603  [R-0603]
R43  5K11  Case Code (Imperial): 0603  [R-0603]
R44  22K  Case Code (Imperial): 0603  [R-0603]
R45  5K11  Case Code (Imperial): 0603  [R-0603]
R46  22K  Case Code (Imperial): 0603  [R-0603]
R59  100K  Case Code (Imperial): 0603  [R-0603]
R60  100K  Case Code (Imperial): 0603  [R-0603]
TP5  MECH-TESTPOINT  [MECH-TESTPOINT]  (value not drawn)  (no BOM)
TP6  MECH-TESTPOINT  [MECH-TESTPOINT]  (value not drawn)  (no BOM)
TP7  MECH-TESTPOINT  [MECH-TESTPOINT]  (value not drawn)  (no BOM)
TP8  MECH-TESTPOINT  [MECH-TESTPOINT]  (value not drawn)  (no BOM)
TP45  MECH-TESTPOINT  [MECH-TESTPOINT]  (value not drawn)  (no BOM)
TP47  MECH-TESTPOINT  [MECH-TESTPOINT]  (value not drawn)  (no BOM)
TP48  MECH-TESTPOINT  [MECH-TESTPOINT]  (value not drawn)  (no BOM)
TP49  MECH-TESTPOINT  [MECH-TESTPOINT]  (value not drawn)  (no BOM)
TP50  MECH-TESTPOINT  [MECH-TESTPOINT]  (value not drawn)  (no BOM)
TP51  MECH-TESTPOINT  [MECH-TESTPOINT]  (value not drawn)  (no BOM)
TP52  MECH-TESTPOINT  [MECH-TESTPOINT]  (value not drawn)  (no BOM)
TP53  MECH-TESTPOINT  [MECH-TESTPOINT]  (value not drawn)  (no BOM)
TP54  MECH-TESTPOINT  [MECH-TESTPOINT]  (value not drawn)  (no BOM)
TP55  MECH-TESTPOINT  [MECH-TESTPOINT]  (value not drawn)  (no BOM)
TP56  MECH-TESTPOINT  [MECH-TESTPOINT]  (value not drawn)  (no BOM)
TP57  MECH-TESTPOINT  [MECH-TESTPOINT]  (value not drawn)  (no BOM)
TP58  MECH-TESTPOINT  [MECH-TESTPOINT]  (value not drawn)  (no BOM)
TP59  MECH-TESTPOINT  [MECH-TESTPOINT]  (value not drawn)  (no BOM)
TP60  MECH-TESTPOINT  [MECH-TESTPOINT]  (value not drawn)  (no BOM)
TP61  MECH-TESTPOINT  [MECH-TESTPOINT]  (value not drawn)  (no BOM)
TP62  MECH-TESTPOINT  [MECH-TESTPOINT]  (value not drawn)  (no BOM)
TP63  MECH-TESTPOINT  [MECH-TESTPOINT]  (value not drawn)  (no BOM)
TP64  MECH-TESTPOINT  [MECH-TESTPOINT]  (value not drawn)  (no BOM)
TP65  MECH-TESTPOINT  [MECH-TESTPOINT]  (value not drawn)  (no BOM)
TP66  MECH-TESTPOINT  [MECH-TESTPOINT]  (value not drawn)  (no BOM)
TP67  MECH-TESTPOINT  [MECH-TESTPOINT]  (value not drawn)  (no BOM)
TP68  MECH-TESTPOINT  [MECH-TESTPOINT]  (value not drawn)  (no BOM)
U8  LM2904B  [SOIC8-D0008A_M]  (part A of 2)
U9  AD7124-8  [32-WFQFN EP]
Y2  SG-210STF  [CRYSTAL-2.5X2]

### Ports
IEXC1_RTD1 (out), IEXC1_RTD2 (out), IEXC1_RTN (in), OSC_ST (in), PN3092_1 (in), PN3092_2 (in), RTDN1 (in), RTDN2 (in), RTDP1 (in), RTDP2 (in), SPI_CS (in), SPI_MISO (out), SPI_MOSI (in), SPI_SCLK (in), SYNC (in), XP5_RTN (in), XP5_VDRIVE (out), XP5N1 (in), XP5N2 (in), XP5P1 (in), XP5P2 (in)

### Nets
+3V3: C91.1 FB7.1
+3V3_ADC: C74.1 C75.1 C92.1 C95.1 FB7.2 FB13.2 TP49.1 U9.2(IOVDD) Y2.4(VDD)
+3V3_AVDD: C76.1 C77.1 C79.1 FB13.1 R29.1 TP50.1 U9.26(AVDD)
+VIN_AVDD: C70.1 FB12.1 R18.1 U8.8(V+)
+VIN_EMI: FB12.2
GND: C66.1 C67.2 C70.2 C71.1 C72.2 C73.2 C74.2 C75.2 C76.2 C77.2 C79.2 C80.1 C81.2 C82.2 C83.2 C84.2 C85.2 C87.1 C88.2 C90.1 C91.2 C92.2 C93.2 C94.2 C95.2 R24.2 R27.2 R36.2 R41.2 R44.2 R46.2 U8.4(V-) U9.3(DGND) U9.11(AIN7/IOUT/VBIAS) U9.23(AVSS) U9.EP Y2.2(GND)
IEXC1_RTD1: U9.4(AIN0/IOUT/VBIAS) ; port IEXC1_RTD1
IEXC1_RTD2: U9.7(AIN3/IOUT/VBIAS/P2) ; port IEXC1_RTD2
IEXC2_BRIDGE: R20.1 R22.1 TP5.1 U8.3(IN1+) U9.10(AIN6/IOUT/VBIAS)
OSC_2M4576: TP45.1 U9.31(CLK) Y2.3(OUT)
OSC_ST: Y2.1(~{ST}) ; port OSC_ST
PN3092_1: R59.1 ; port PN3092_1
PN3092_2: R60.1 ; port PN3092_2
RTDN1: R26.1 ; port RTDN1
RTDN2: R31.1 ; port RTDN2
RTDP1: R19.1 ; port RTDP1
RTDP2: R28.1 ; port RTDP2
SPI_CS: TP55.1 U9.32(CS) ; port SPI_CS
SPI_MISO: TP58.1 U9.28(DOUT/ARDY) ; port SPI_MISO
SPI_MOSI: TP56.1 U9.29(DIN) ; port SPI_MOSI
SPI_SCLK: TP54.1 U9.30(SCLK) ; port SPI_SCLK
SYNC: U9.27(SYNC) ; port SYNC
VREFN1: C68.2 C72.1 R23.2 R35.2 TP57.1 U9.13(REFIN1(−))
VREFN2: R39.2 R41.1 TP63.1 U9.21(AIN15/IOUT/VBIAS/REFIN2(-))
VREFP1: C66.2 C68.1 R20.2 R33.2 TP53.1 U9.12(REFIN1(+))
VREFP2: R39.1 TP8.1 U9.20(AIN14/IOUT/VBIAS/REFIN2(+)) ; port IEXC1_RTN
XP5_RTN: R34.1 R36.1 ; port XP5_RTN
XP5_VDRIVE: R30.2 ; port XP5_VDRIVE
XP5N1: R38.1 ; port XP5N1
XP5N2: R42.1 ; port XP5N2
XP5P1: R37.1 ; port XP5P1
XP5P2: R40.1 ; port XP5P2
NetC67_1: C67.1 C69.1 R19.2 TP47.1 U9.5(AIN1/IOUT/VBIAS)
NetC69_2: C69.2 C71.2 R26.2 TP51.1 U9.6(AIN2/IOUT/VBIAS/P1)
NetC73_1: C73.1 C78.1 R28.2 TP52.1 U9.8(AIN4/IOUT/VBIAS/P3)
NetC78_2: C78.2 C80.2 R31.2 TP59.1 U9.9(AIN5/IOUT/VBIAS/P4)
NetC81_1: C81.1 R32.2 R33.1
NetC82_1: C82.1 R34.2 R35.1
NetC83_1: C83.1 U9.1(REGCAPD)
NetC84_1: C84.1 U9.24(REGCAPA)
NetC85_1: C85.1 C86.1 R37.2 TP60.1 U9.14(AIN8/IOUT/VBIAS)
NetC86_2: C86.2 C87.2 R38.2 TP61.1 U9.15(AIN9/IOUT/VBIAS)
NetC88_1: C88.1 C89.1 R40.2 TP62.1 U9.16(AIN10/IOUT/VBIAS)
NetC89_2: C89.2 C90.2 R42.2 TP64.1 U9.17(AIN11/IOUT/VBIAS)
NetC93_1: C93.1 R43.2 TP66.1 U9.18(AIN12/IOUT/VBIAS)
NetC94_1: C94.1 R45.2 TP68.1 U9.19(AIN13/IOUT/VBIAS)
NetQ4_1: Q4.1 R21.1
NetQ4_2: Q4.2 R25.1 R30.3 TP7.1
NetQ4_3: Q4.3 R18.2
NetR21_2: R21.2 U8.1(OUT1)
NetR22_2: R22.2 R23.1 R24.1 TP6.1
NetR25_2: R25.2 R27.1 TP48.1 U8.2(IN1-)
NetR29_2: R29.2 R30.1 R32.1
NetR43_1: R43.1 R44.1 R59.2 TP65.1
NetR45_1: R45.1 R46.1 R60.2 TP67.1

Not connected (* = marked no-connect by the designer): U9 22(REFOUT)* 25(PSW)*

### Layout directives
net class ADC: +3V3, +3V3_ADC, +3V3_AVDD, +VIN_AVDD, +VIN_EMI, GND, IEXC2_BRIDGE, OSC_2M4576, VREFN1, VREFN2, VREFP1, VREFP2

### Notes on the sheet
- DESIGN NOTE:
  HIGH|OPEN OSC
  LOW NON-OSC
- DESIGN NOTE:
  500uA*5.11k=2.55V
  500uA*249R=0.1245
- DESIGN NOTE:
  TP=2.86V
- DESIGN NOTE:
  TP=0.124V
- DESIGN NOTE:
  VDrive=VRef*(1+RF/RI)
  VRef=Iexc*(RREF+RHeadroom)
- (near TP7) DESIGN NOTE:
  TP=10V
- (near U9) AD7124-8
- (near TP8) DESIGN NOTE:
  TP=2.86V
- DESIGN NOTE:
  SET AIN0 as IOUT in order to provide reference voltage for RTD1
  SET AIN1 as IOUT in order to provide reference voltage for RTD2
  XP5 calibrated to 10V according to datasheet. We got two options for XP5 supply.
  SET AIN2 as IOUT in order to provide reference voltage for XP5
  If you want to supply sensor with 3V3 you have to dont fit R23 and R20 also  fit r34 and r32
  You dont need to set AIN3 as a IOUT while using 3V3 option.
- DESIGN NOTE:
  PN3092 =0..10V input
  IF you want to drive with current you have to change 100k->0R and 22k->150R
- Date
- Name
- Product
- Variante:
- Editor
- Check
- Ref.
- Schematic
- File
- PCB-Number
- Rev.
- Description
- Sheet Size
- A3
- Sheet:
- /
- (in symbol IC-LM2904BQDRQ1, part A) +; -